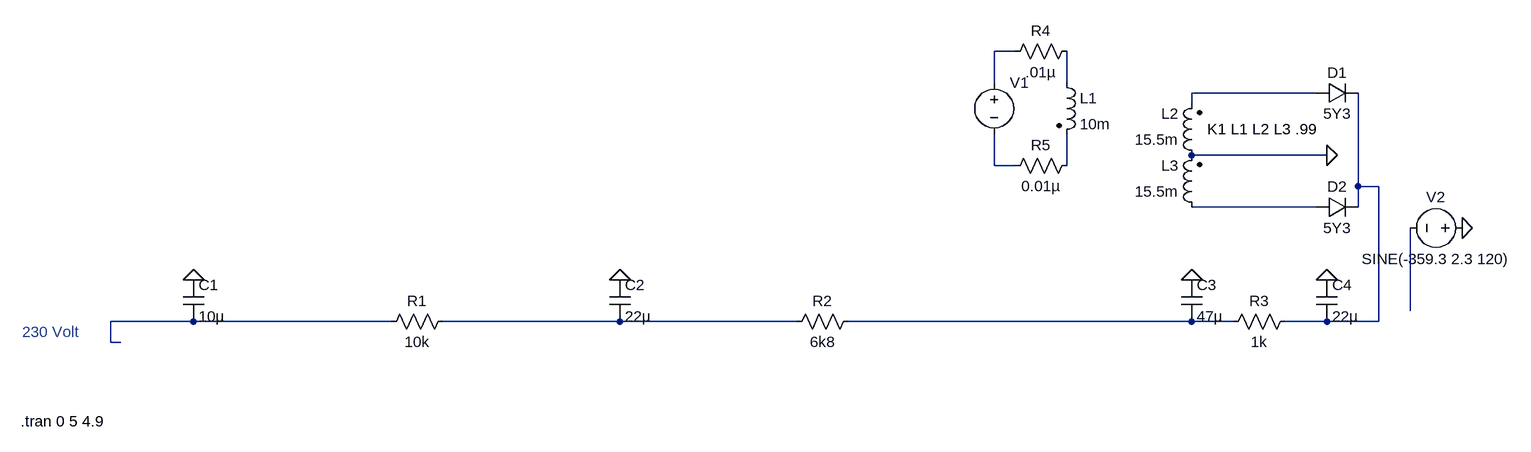
[diagram p0: schematic Draft1.asc]
Draft1.asc, the LTspice schematic file:
Version 4
SHEET 1 880 680
WIRE -128 -64 -160 -64
WIRE -160 -16 -160 -64
WIRE -48 -16 -48 -64
WIRE 336 0 144 0
WIRE 144 16 144 0
WIRE 352 96 144 96
WIRE -160 112 -160 64
WIRE -128 112 -160 112
WIRE -48 112 -48 64
WIRE 400 144 400 0
WIRE 432 144 400 144
WIRE 336 176 144 176
WIRE 400 176 400 144
WIRE 480 336 480 208
WIRE -1392 352 -1520 352
WIRE -1088 352 -1392 352
WIRE -736 352 -1008 352
WIRE -464 352 -736 352
WIRE 144 352 -384 352
WIRE 208 352 144 352
WIRE 352 352 288 352
WIRE 432 352 432 144
WIRE 432 352 352 352
WIRE -1520 384 -1520 352
WIRE -1504 384 -1520 384
FLAG -1392 288 0
FLAG -736 288 0
FLAG 144 288 0
FLAG 352 288 0
FLAG 352 96 0
FLAG 560 208 0
SYMBOL res -992 336 R90
WINDOW 0 0 56 VBottom 0
WINDOW 3 32 56 VTop 0
SYMATTR InstName R1
SYMATTR Value 10k
SYMBOL cap -1408 288 R0
SYMATTR InstName C1
SYMATTR Value 10µ
SYMATTR SpiceLine V=450
SYMBOL cap -752 288 R0
SYMATTR InstName C2
SYMATTR Value 22µ
SYMATTR SpiceLine V=450
SYMBOL res -368 336 R90
WINDOW 0 0 56 VBottom 0
WINDOW 3 32 56 VTop 0
SYMATTR InstName R2
SYMATTR Value 6k8
SYMATTR SpiceLine pwr=1
SYMBOL cap 128 288 R0
SYMATTR InstName C3
SYMATTR Value 47µ
SYMATTR SpiceLine V=450
SYMBOL res 304 336 R90
WINDOW 0 0 56 VBottom 0
WINDOW 3 32 56 VTop 0
SYMATTR InstName R3
SYMATTR Value 1k
SYMATTR SpiceLine pwr=5
SYMBOL cap 336 288 R0
SYMATTR InstName C4
SYMATTR Value 22µ
SYMATTR SpiceLine V=450
SYMBOL voltage -160 -32 R0
WINDOW 3 24 104 Invisible 0
WINDOW 123 0 0 Left 0
WINDOW 39 0 0 Left 0
SYMATTR Value SINE(0 326 60)
SYMATTR InstName V1
SYMBOL ind2 -64 -32 R0
SYMATTR InstName L1
SYMATTR Value 10m
SYMATTR Type ind
SYMBOL ind2 160 112 R180
WINDOW 0 36 80 Left 0
WINDOW 3 36 40 Left 0
SYMATTR InstName L2
SYMATTR Value 15.5m
SYMATTR Type ind
SYMBOL ind2 160 192 R180
WINDOW 0 36 80 Left 0
WINDOW 3 36 40 Left 0
SYMATTR InstName L3
SYMATTR Value 15.5m
SYMATTR Type ind
SYMBOL res -32 -80 R90
WINDOW 0 0 56 VBottom 0
WINDOW 3 32 56 VTop 0
SYMATTR InstName R4
SYMATTR Value .01µ
SYMBOL res -32 96 R90
WINDOW 0 0 56 VBottom 0
WINDOW 3 32 56 VTop 0
SYMATTR InstName R5
SYMATTR Value 0.01µ
SYMBOL diode 336 16 R270
WINDOW 0 32 32 VTop 0
WINDOW 3 0 32 VBottom 0
SYMATTR InstName D1
SYMATTR Value 5Y3
SYMBOL diode 336 192 R270
WINDOW 0 32 32 VTop 0
WINDOW 3 0 32 VBottom 0
SYMATTR InstName D2
SYMATTR Value 5Y3
SYMBOL voltage 576 208 R90
WINDOW 0 -32 56 VBottom 0
WINDOW 3 32 56 VTop 0
WINDOW 123 0 0 Left 0
WINDOW 39 0 0 Left 0
SYMATTR InstName V2
SYMATTR Value SINE(-359.3 2.3 120)
TEXT -1656 368 Left 0 ;230 Volt
TEXT 168 56 Left 0 !K1 L1 L2 L3 .99
TEXT -1658 506 Left 0 !.tran 0 5 4.9

The netlist it stands for:
* Draft1.asc
R1 N010 N009 10k
C1 0 N009 10µ V=450
C2 0 N010 22µ V=450
R2 N011 N010 6k8 pwr=1
C3 0 N011 47µ V=450
R3 N006 N011 1k pwr=5
C4 0 N006 22µ V=450
V1 N001 N004 SINE(0 326 60)
L1 N002 N005 10m
L2 0 N003 15.5m
L3 N007 0 15.5m
R4 N002 N001 .01µ
R5 N005 N004 0.01µ
D1 N003 N006 5Y3
D2 N007 N006 5Y3
V2 0 N008 SINE(-359.3 2.3 120)
.model D D
.lib standard.dio
* 230 Volt
K1 L1 L2 L3 .99
.tran 0 5 4.9
.backanno
.end